# Altium schematic sheet OK1050-C_V1.2_TFcard.SchDoc
size A3; Revision: 1.2; SheetNumber: 5; SheetTotal: 7
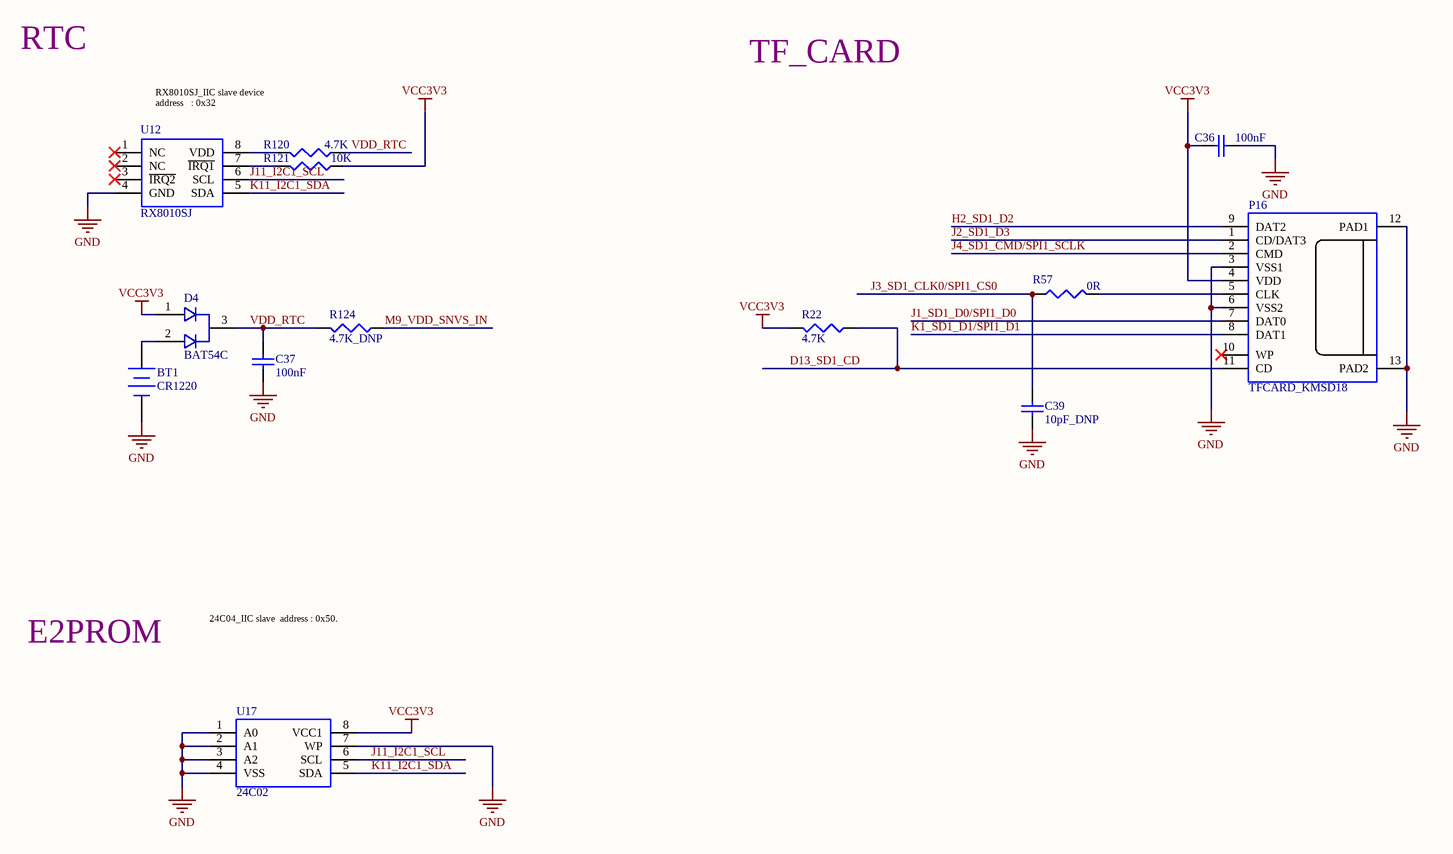
[diagram p0: OK1050-C_V1.2_TFcard.SchDoc]

## Parts
BT1  CR1220  [BH-1220 BATTERY]
C36  100nF  [0603C+]
C37  100nF  [0603C+]
C39  10pF_DNP  [0603C+]
D4  BAT54C  [SOT23]
P16  TFCARD_KMSD18  [TF-CARD]
R22  4.7K  [0603R+]
R57  0R  [0603R+]
R120  4.7K  [0603R+]
R121  10K  [0603R+]
R124  4.7K_DNP  [0603R+]
U12  RX8010SJ  [RX8010SJ]
U17  24C02  [24C04_SO8]

## Nets
GND: BT1.2(-) C36.1 C37.1 C39.2 P16.3(VSS1) P16.6(VSS2) P16.12(PAD1) P16.13(PAD2) U12.4(GND) U17.1(A0) U17.2(A1) U17.3(A2) U17.4(VSS) U17.7(WP)
VCC3V3: C36.2 D4.1 P16.4(VDD) R22.2 R121.1 U17.8(VCC1)
D13_SD1_CD: P16.11(CD) R22.1
H2_SD1_D2: P16.9(DAT2)
J1_SD1_D0/SPI1_D0: P16.7(DAT0)
J2_SD1_D3: P16.1(CD/DAT3)
J3_SD1_CLK0/SPI1_CS0: C39.1 R57.1
J4_SD1_CMD/SPI1_SCLK: P16.2(CMD)
J11_I2C1_SCL: U12.6(SCL) U17.6(SCL)
K1_SD1_D1/SPI1_D1: P16.8(DAT1)
K11_I2C1_SDA: U12.5(SDA) U17.5(SDA)
M9_VDD_SNVS_IN: R124.1
VDD_RTC: C37.2 D4.3 R120.1 R124.2
NetBT1_1: BT1.1(+) D4.2
NetP16_5: P16.5(CLK) R57.2
NetR120_2: R120.2 U12.8(VDD)
NetR121_2: R121.2 U12.7(~{IRQ1})

Not connected (* = marked no-connect by the designer): P16 10(WP)*; U12 1(NC)* 2(NC)* 3(~{IRQ2})*

## Notes on the sheet
- RTC
- TF_CARD
- RX8010SJ_IIC slave device address   : 0x32
- E2PROM
- 24C04_IIC slave  address : 0x50.
- 设计
- 审核
- 工艺
- 图纸名称
- 孙木
- 批准
- 标准化
- 日期
- 版本
- 页码
- 第
- 页
- 共

## Library data of the parts
BT1 = Battery: Multicell Battery; Published: 24-Mar-1999; LatestRevisionDate: 17-Jul-2002; LatestRevisionNote: Re-released for DXP Platform.; PackageReference: BAT-2; Publisher: Altium Limited; PackageDescription: Battery; 2 Leads
C36 C37 C39 = Cap: Capacitor; Published: 8-Jun-2000; LatestRevisionDate: 17-Jul-2002; LatestRevisionNote: Re-released for DXP Platform.; PackageReference: RAD-0.3; Publisher: Altium Limited; PackageDescription: Radial Cap, Thru-Hole; 2 Leads; 0.3 in Pin Spacing
  C36 C37: Value: 100nF
  C39: Value: 10pF_DNP
P16 = SDCARD_KMSD18
R22 R57 R120 R121 R124 = Res3: Resistor; Published: 8-Jun-2000; LatestRevisionDate: 29-May-2009; LatestRevisionNote: IPC-7351 Footprint Added.; PackageReference: J1-0603; Publisher: Altium Limited; PackageDescription: Chip Resistor
  R22 R120: Value: 4.7K
  R57: Value: 0R
  R121: Value: 10K
  R124: Value: 4.7K_DNP
U17 = 24C04_SO8
D4 = BAT54C: Value: BAT54C
U12 = RX8010SJ: Value: RX8010SJ